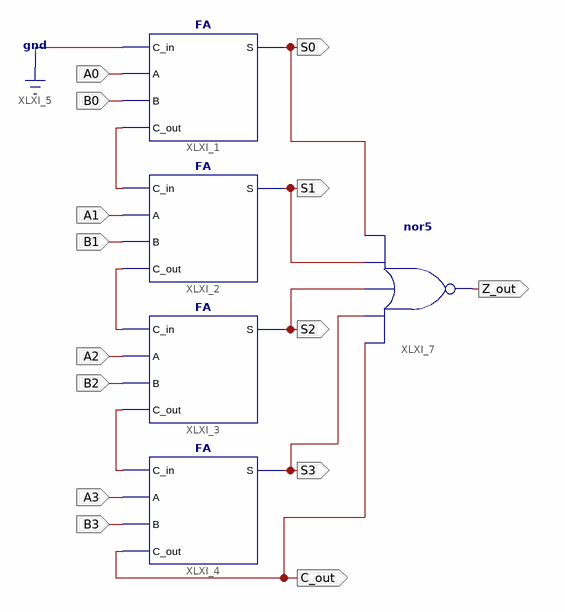
[diagram p0: schematic sheet 1]
// Xilinx ISE schematic RCA.sch (spartan3e) as structural Verilog: 5 symbols, 14 ports
module RCA (
  input  A0,
  input  B0,
  input  A2,
  input  B2,
  input  A1,
  input  B1,
  input  A3,
  input  B3,
  output C_out,
  output S0,
  output S1,
  output S2,
  output Z_out,
  output S3
);

  wire XLXN_5, XLXN_7, XLXN_11;

  FA XLXI_1 (.A(A0), .B(B0), .C_in(1'b0), .C_out(XLXN_5), .S(S0));
  FA XLXI_2 (.A(A1), .B(B1), .C_in(XLXN_5), .C_out(XLXN_7), .S(S1));
  FA XLXI_3 (.A(A2), .B(B2), .C_in(XLXN_7), .C_out(XLXN_11), .S(S2));
  FA XLXI_4 (.A(A3), .B(B3), .C_in(XLXN_11), .C_out(C_out), .S(S3));
  nor XLXI_7 (Z_out, C_out, S3, S2, S1, S0);
endmodule
